# Altium schematic sheet CC_LED_Drive.SchDoc: Constant-current LED Drive
size A4; DrawnBy: Samyar Sadat Akhavi; Revision: 1.0; SheetNumber: 13; SheetTotal: 14
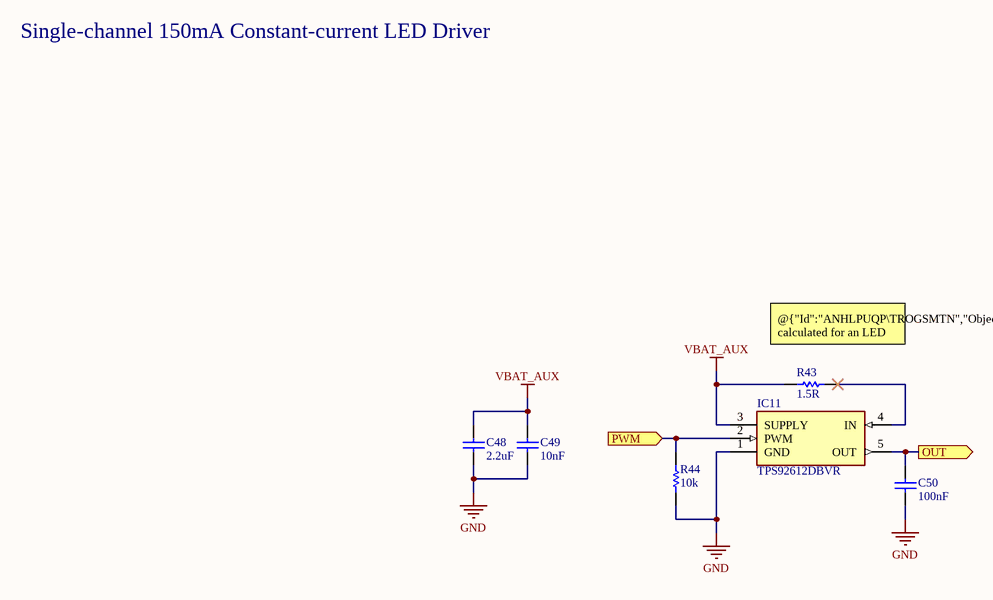
[diagram p0: CC_LED_Drive.SchDoc]

## Parts
?  (no value)  (graphical)
C48  2.2uF  [CAP_SMD_603]
C49  10nF  [CAP_SMD_603]
C50  100nF  [CAP_SMD_603]
IC11  TPS92612DBVR  [SOT95P280X145-5N]
R43  1.5R  [RES_0603]
R44  10k  [RES_0603]

## Ports
OUT (out, see Lighting[3A]), PWM (in, see Lighting[2A])

## Nets
GND: C48.1 C49.1 C50.1 IC11.1(GND) R44.2
VBAT_AUX: C48.2 C49.2 IC11.3(SUPPLY) R43.2
OUT: C50.2 IC11.5(OUT) ; port OUT
PWM: IC11.2(PWM) R44.1 ; port PWM
NetIC11_4: IC11.4(IN) R43.1

## Notes on the sheet
- Single-channel 150mA Constant-current LED Driver
- (near R43) @{"Id":"ANHLPUQP\TROGSMTN","ObjectType":2} calculated for an LED current of 65mA.
- Sub-Project:
- Size:
- Drawn By:
- Revision:
- Date:
- File:
- Sheet:
- of

## Library data of the parts
? = Standard Title Block
C48 C49 = Non-polar Capacitor: Generic Ceramic Capacitor; Voltage: 16V
  C48: Value: 2.2uF
  C49: Value: 10nF
C50 = Non-polar Capacitor: Generic Ceramic Capacitor; Voltage: 6.3V; Value: 100nF
IC11 = TPS92612DBVR: Integrated Circuit; Manufacturer_Name: Texas Instruments; Datasheet Link: https://www.ti.com/lit/gpn/TPS92612; Height: 1.45mm; Manufacturer_Part_Number: TPS92612DBVR; Mouser Part Number: 595-TPS92612DBVR; Mouser Price/Stock: https://www.mouser.co.uk/ProductDetail/Texas-Instruments/TPS92612DBVR?qs=vmHwEFxEFR8rIdrHkxYxuQ%3D%3D; Arrow Part Number: TPS92612DBVR; Arrow Price/Stock: https://www.arrow.com/en/products/tps92612dbvr/texas-instruments?utm_currency=USD&region=nac
R43 R44 = Resistor: Power: 1/8W
  R43: Value: 1.5R
  R44: Value: 10k